# EAGLE schematic ToolTron_RFIDBoxv2.0 (EAGLE 6.2)
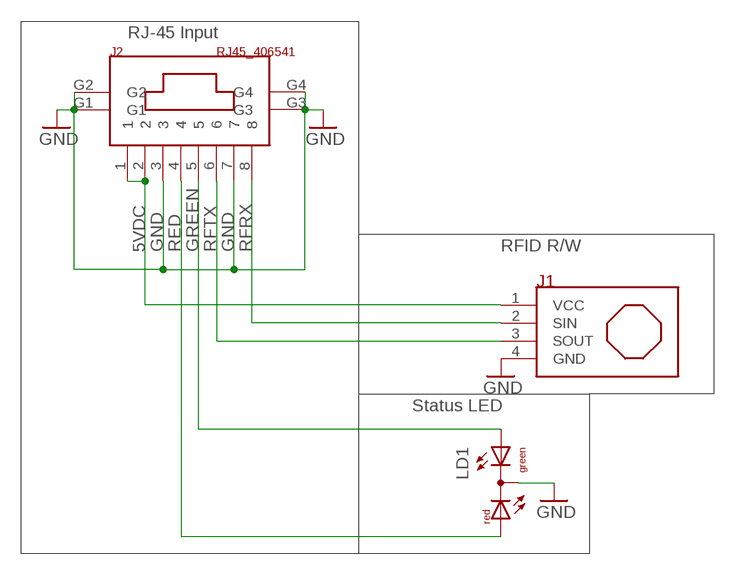
[diagram p0: schematic, sheet 1]

## Parts
J1  RFID_SERIAL_R/W  [1X4_HEADER]
J2  RJ45_406541  [1-406541-1]
LD1  DUOLED-RG-C  [DUOLED-C-5MM]

## Nets
5VDC: J1.1(VCC) J2.1 J2.2
GND: J1.4(GND) J2.3 J2.7 J2.G1 J2.G2 J2.G3 J2.G4 LD1.C
GREEN: J2.5 LD1.AX(AG)
RED: J2.4 LD1.AR
RFRX: J1.2(SIN) J2.8
RFTX: J1.3(SOUT) J2.6

## Notes on the sheet
- RJ-45 Input
- RFID R/W
- Status LED

## Library data of the parts
J1 = npol_custom:RFID_SERIAL_R/W
J2 = npol_custom:RJ45_406541: RJ45 Jack TE Connectivity 1-406541-1 Digikey A97716-ND
LD1 = led:DUOLED-RG-C: DUO LED 2 colors (red/green), 5 mm, round, common Cathode www.ligitek.com or other producers.